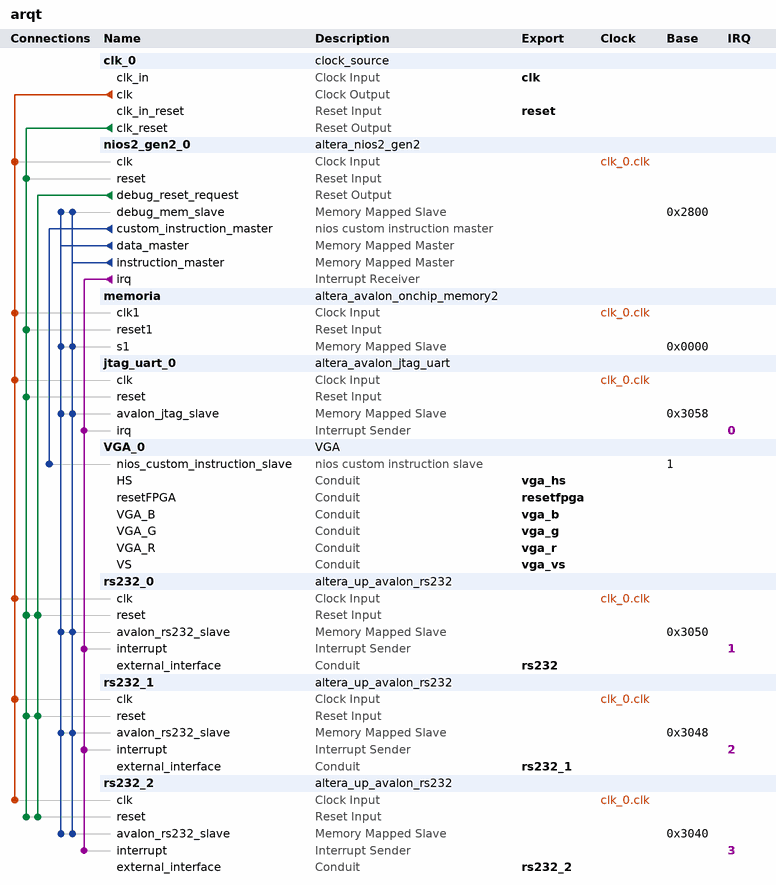
[diagram p0: system contents]
# Platform Designer (Qsys) system arqt, Cyclone IV E EP4CE6E22C8
# Parameters at their usual value, and those the tool derives, are not listed.
package require -exact qsys 16.1
create_system arqt
set_project_property DEVICE_FAMILY {Cyclone IV E}
set_project_property DEVICE EP4CE6E22C8

add_instance clk_0 clock_source 16.1
set_instance_parameter_value clk_0 clockFrequency 50000000

add_instance nios2_gen2_0 altera_nios2_gen2 16.1
set_instance_parameter_value nios2_gen2_0 dcache_size 2048
set_instance_parameter_value nios2_gen2_0 exceptionSlave memoria.s1
set_instance_parameter_value nios2_gen2_0 icache_size 4096
set_instance_parameter_value nios2_gen2_0 impl Tiny
set_instance_parameter_value nios2_gen2_0 resetSlave memoria.s1

add_instance memoria altera_avalon_onchip_memory2 16.1
set_instance_parameter_value memoria dataWidth 32
set_instance_parameter_value memoria dualPort false
set_instance_parameter_value memoria initMemContent true
set_instance_parameter_value memoria initializationFileName onchip_mem.hex
set_instance_parameter_value memoria memorySize 8192
set_instance_parameter_value memoria useNonDefaultInitFile true

add_instance jtag_uart_0 altera_avalon_jtag_uart 16.1
set_instance_parameter_value jtag_uart_0 simInteractiveOptions NO_INTERACTIVE_WINDOWS

add_instance VGA_0 VGA 1.0

add_instance rs232_0 altera_up_avalon_rs232 16.1
set_instance_parameter_value rs232_0 baud 115200
set_instance_parameter_value rs232_0 parity None

add_instance rs232_1 altera_up_avalon_rs232 16.1
set_instance_parameter_value rs232_1 baud 115200
set_instance_parameter_value rs232_1 parity None

add_instance rs232_2 altera_up_avalon_rs232 16.1
set_instance_parameter_value rs232_2 baud 115200
set_instance_parameter_value rs232_2 parity None

# connections
add_connection clk_0.clk jtag_uart_0.clk clock
add_connection clk_0.clk memoria.clk1 clock
add_connection clk_0.clk nios2_gen2_0.clk clock
add_connection clk_0.clk rs232_0.clk clock
add_connection clk_0.clk rs232_1.clk clock
add_connection clk_0.clk rs232_2.clk clock
add_connection clk_0.clk_reset jtag_uart_0.reset reset
add_connection clk_0.clk_reset memoria.reset1 reset
add_connection clk_0.clk_reset nios2_gen2_0.reset reset
add_connection clk_0.clk_reset rs232_0.reset reset
add_connection clk_0.clk_reset rs232_1.reset reset
add_connection clk_0.clk_reset rs232_2.reset reset
add_connection nios2_gen2_0.debug_reset_request rs232_0.reset reset
add_connection nios2_gen2_0.debug_reset_request rs232_1.reset reset
add_connection nios2_gen2_0.debug_reset_request rs232_2.reset reset
add_connection nios2_gen2_0.data_master jtag_uart_0.avalon_jtag_slave avalon
set_connection_parameter_value nios2_gen2_0.data_master/jtag_uart_0.avalon_jtag_slave baseAddress 0x3058
add_connection nios2_gen2_0.data_master memoria.s1 avalon
set_connection_parameter_value nios2_gen2_0.data_master/memoria.s1 baseAddress 0x0000
add_connection nios2_gen2_0.data_master nios2_gen2_0.debug_mem_slave avalon
set_connection_parameter_value nios2_gen2_0.data_master/nios2_gen2_0.debug_mem_slave baseAddress 0x2800
add_connection nios2_gen2_0.data_master rs232_0.avalon_rs232_slave avalon
set_connection_parameter_value nios2_gen2_0.data_master/rs232_0.avalon_rs232_slave baseAddress 0x3050
add_connection nios2_gen2_0.data_master rs232_1.avalon_rs232_slave avalon
set_connection_parameter_value nios2_gen2_0.data_master/rs232_1.avalon_rs232_slave baseAddress 0x3048
add_connection nios2_gen2_0.data_master rs232_2.avalon_rs232_slave avalon
set_connection_parameter_value nios2_gen2_0.data_master/rs232_2.avalon_rs232_slave baseAddress 0x3040
add_connection nios2_gen2_0.instruction_master jtag_uart_0.avalon_jtag_slave avalon
set_connection_parameter_value nios2_gen2_0.instruction_master/jtag_uart_0.avalon_jtag_slave baseAddress 0x3058
add_connection nios2_gen2_0.instruction_master memoria.s1 avalon
set_connection_parameter_value nios2_gen2_0.instruction_master/memoria.s1 baseAddress 0x0000
add_connection nios2_gen2_0.instruction_master nios2_gen2_0.debug_mem_slave avalon
set_connection_parameter_value nios2_gen2_0.instruction_master/nios2_gen2_0.debug_mem_slave baseAddress 0x2800
add_connection nios2_gen2_0.instruction_master rs232_0.avalon_rs232_slave avalon
set_connection_parameter_value nios2_gen2_0.instruction_master/rs232_0.avalon_rs232_slave baseAddress 0x3050
add_connection nios2_gen2_0.instruction_master rs232_1.avalon_rs232_slave avalon
set_connection_parameter_value nios2_gen2_0.instruction_master/rs232_1.avalon_rs232_slave baseAddress 0x3048
add_connection nios2_gen2_0.instruction_master rs232_2.avalon_rs232_slave avalon
set_connection_parameter_value nios2_gen2_0.instruction_master/rs232_2.avalon_rs232_slave baseAddress 0x3040
add_connection nios2_gen2_0.irq jtag_uart_0.irq interrupt
set_connection_parameter_value nios2_gen2_0.irq/jtag_uart_0.irq irqNumber 0
add_connection nios2_gen2_0.irq rs232_0.interrupt interrupt
set_connection_parameter_value nios2_gen2_0.irq/rs232_0.interrupt irqNumber 1
add_connection nios2_gen2_0.irq rs232_1.interrupt interrupt
set_connection_parameter_value nios2_gen2_0.irq/rs232_1.interrupt irqNumber 2
add_connection nios2_gen2_0.irq rs232_2.interrupt interrupt
set_connection_parameter_value nios2_gen2_0.irq/rs232_2.interrupt irqNumber 3
add_connection nios2_gen2_0.custom_instruction_master VGA_0.nios_custom_instruction_slave nios_custom_instruction
set_connection_parameter_value nios2_gen2_0.custom_instruction_master/VGA_0.nios_custom_instruction_slave CIName vga_0
set_connection_parameter_value nios2_gen2_0.custom_instruction_master/VGA_0.nios_custom_instruction_slave baseAddress 1

# exported interfaces
add_interface clk clock sink
set_interface_property clk EXPORT_OF clk_0.clk_in
add_interface reset reset sink
set_interface_property reset EXPORT_OF clk_0.clk_in_reset
add_interface resetfpga conduit end
set_interface_property resetfpga EXPORT_OF VGA_0.resetFPGA
add_interface rs232 conduit end
set_interface_property rs232 EXPORT_OF rs232_0.external_interface
add_interface rs232_1 conduit end
set_interface_property rs232_1 EXPORT_OF rs232_1.external_interface
add_interface rs232_2 conduit end
set_interface_property rs232_2 EXPORT_OF rs232_2.external_interface
add_interface vga_b conduit end
set_interface_property vga_b EXPORT_OF VGA_0.VGA_B
add_interface vga_g conduit end
set_interface_property vga_g EXPORT_OF VGA_0.VGA_G
add_interface vga_hs conduit end
set_interface_property vga_hs EXPORT_OF VGA_0.HS
add_interface vga_r conduit end
set_interface_property vga_r EXPORT_OF VGA_0.VGA_R
add_interface vga_vs conduit end
set_interface_property vga_vs EXPORT_OF VGA_0.VS

set_interconnect_requirement {$system} qsys_mm.clockCrossingAdapter HANDSHAKE
set_interconnect_requirement {$system} qsys_mm.enableEccProtection FALSE
set_interconnect_requirement {$system} qsys_mm.insertDefaultSlave FALSE
set_interconnect_requirement {$system} qsys_mm.maxAdditionalLatency 1

save_system arqt.qsys
